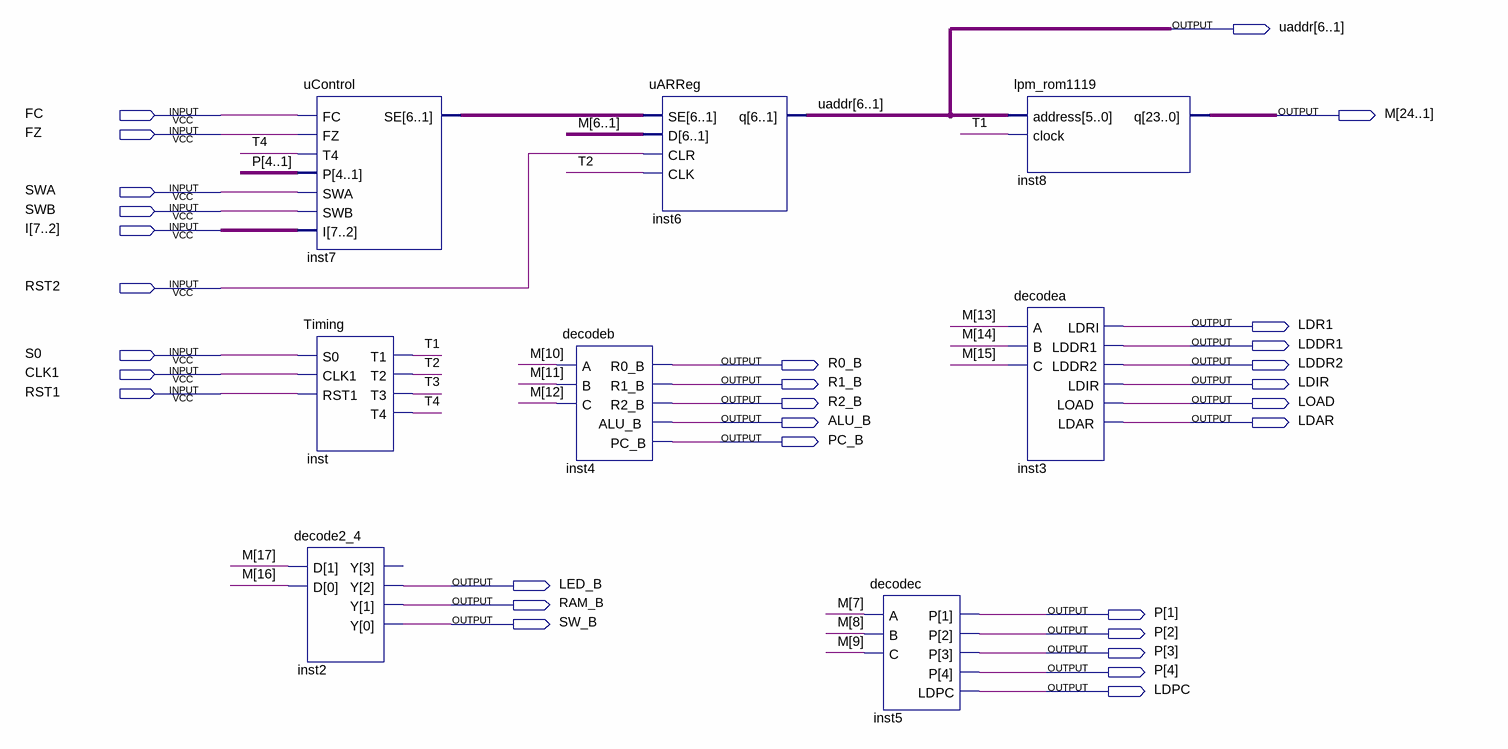
[diagram p0: schematic sheet]
// Quartus schematic uControl1119.bdf as structural Verilog: 8 symbols, 30 pins
module uControl1119 (
  input  FC,
  input  FZ,
  input  SWA,
  input  SWB,
  input  [7:2] I,
  input  RST2,
  input  S0,
  input  CLK1,
  input  RST1,
  output [6:1] uaddr,
  output [24:1] M,
  output LDR1,
  output LDDR1,
  output R0_B,
  output LDDR2,
  output R1_B,
  output LDIR,
  output R2_B,
  output LOAD,
  output ALU_B,
  output LDAR,
  output PC_B,
  output LED_B,
  output RAM_B,
  output [4:1] P,
  output SW_B,
  output LDPC
);

  wire T1, T2, T3, T4;
  wire [5:0] inst7_se;
  wire [3:0] inst2_y_open;  // unused outputs

  uControl inst7 (.FC(FC), .FZ(FZ), .T4(T4), .P(P), .SWA(SWA), .SWB(SWB), .I(I), .SE(inst7_se));
  Timing inst (.S0(S0), .CLK1(CLK1), .RST1(RST1), .T1(T1), .T2(T2), .T3(T3), .T4(T4));
  decode2_4 inst2 (.D(M[17:16]), .Y({inst2_y_open[3], LED_B, RAM_B, SW_B}));
  decodeb inst4 (.A(M[10]), .B(M[11]), .C(M[12]), .R0_B(R0_B), .R1_B(R1_B), .R2_B(R2_B), .ALU_B(ALU_B), .PC_B(PC_B));
  uARReg inst6 (.SE(inst7_se), .D(M[6:1]), .CLR(RST2), .CLK(T2), .q(uaddr));
  decodec inst5 (.A(M[7]), .B(M[8]), .C(M[9]), .P(P), .LDPC(LDPC));
  lpm_rom1119 inst8 (.address(uaddr), .clock(T1), .q(M));
  decodea inst3 (
    .A(M[13]), .B(M[14]), .C(M[15]), .LDRI(LDR1), .LDDR1(LDDR1), .LDDR2(LDDR2), .LDIR(LDIR), .LOAD(LOAD),
    .LDAR(LDAR));
endmodule
